# EAGLE design Qwiic_MultiStar (EAGLE 9.5.2)
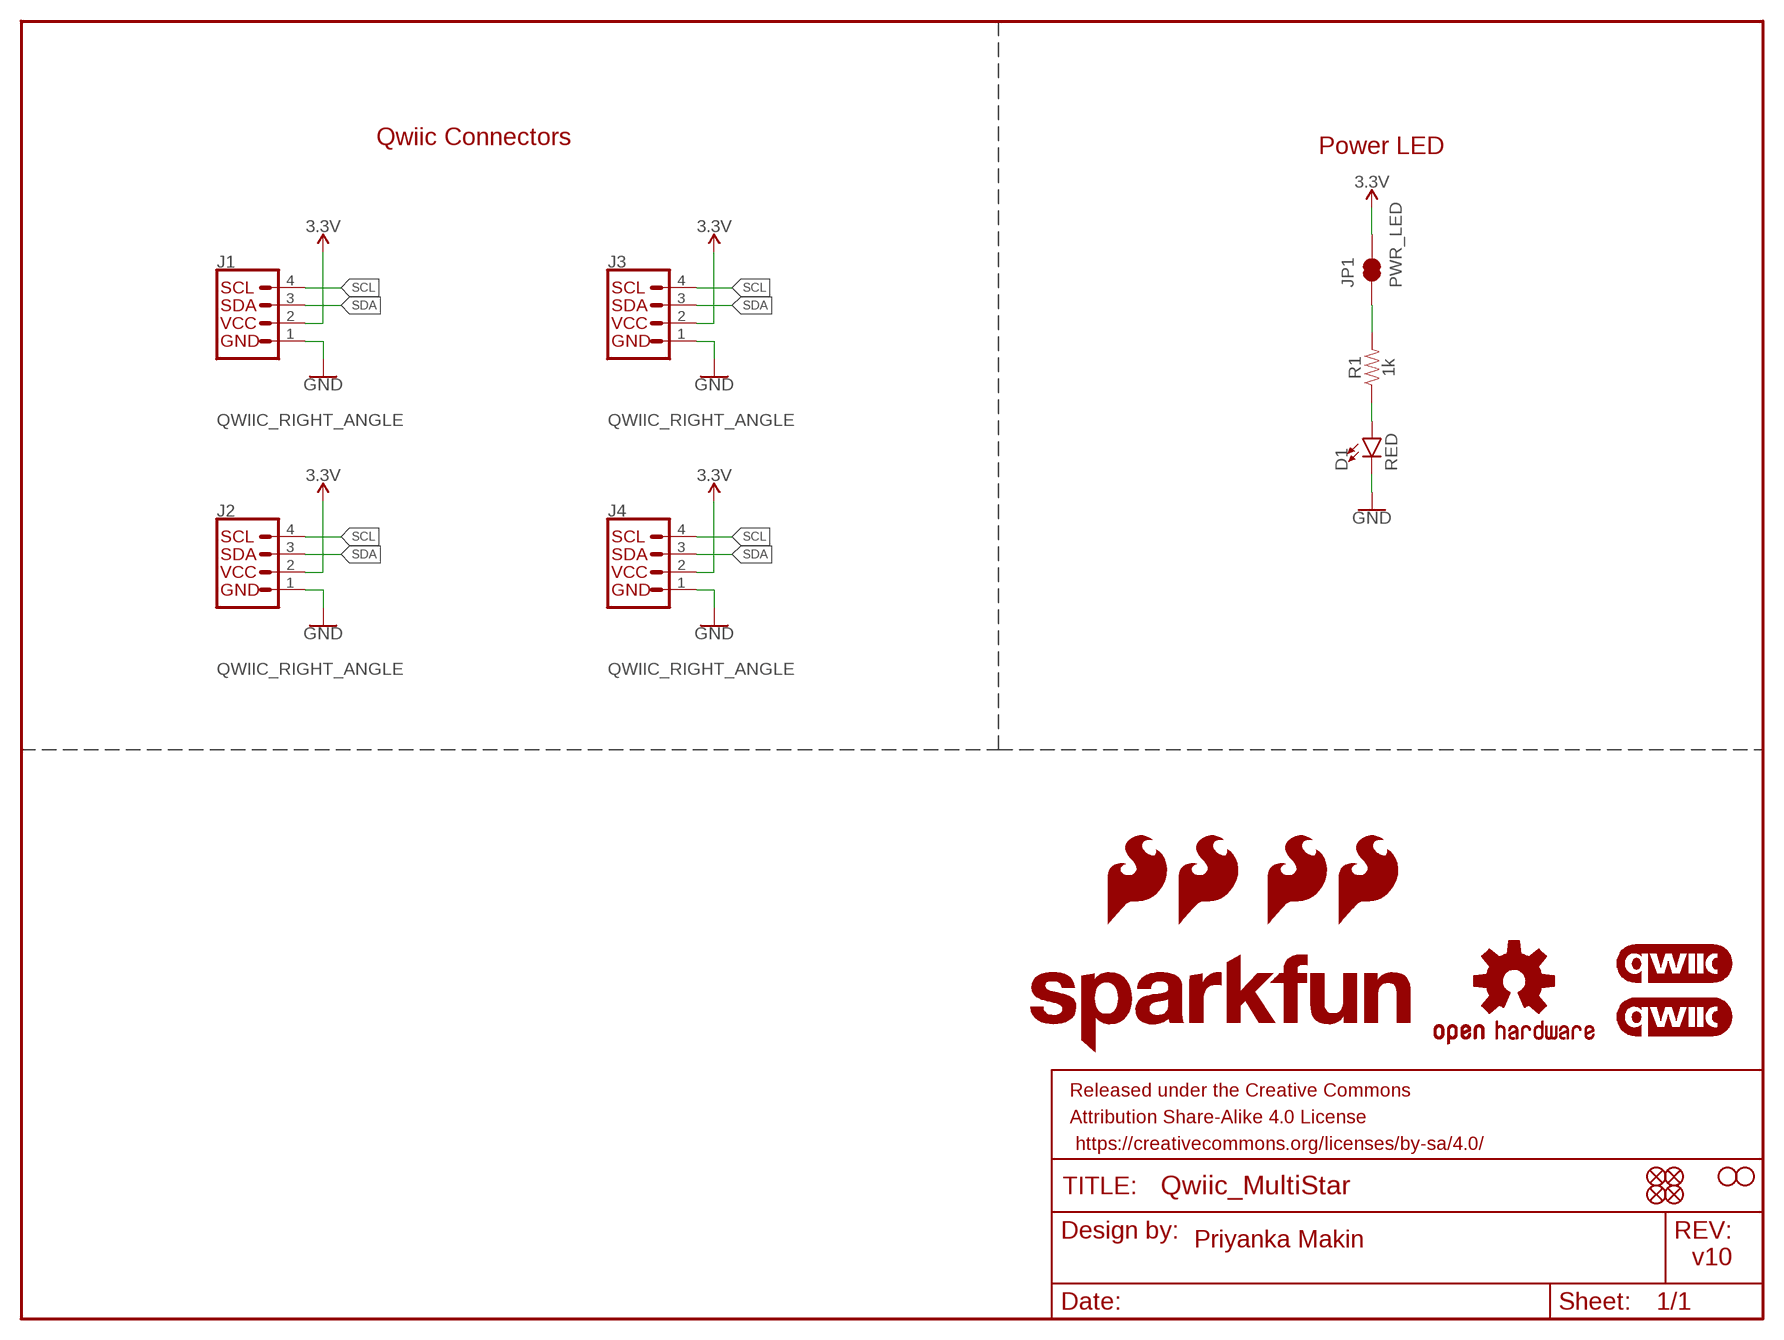
[diagram p0: schematic, sheet 1]

## Parts
D1  RED  LED-RED0603  [LED-0603]
FD1  FIDUCIAL1X2  [FIDUCIAL-1X2]
FD2  FIDUCIAL1X2  [FIDUCIAL-1X2]
FD3  FIDUCIAL1X2  [FIDUCIAL-1X2]
FD4  FIDUCIAL1X2  [FIDUCIAL-1X2]
FRAME1  FRAME-LETTER  [CREATIVE_COMMONS]
H1  STAND-OFFTIGHT  [STAND-OFF-TIGHT]
H2  STAND-OFFTIGHT  [STAND-OFF-TIGHT]
J1  QWIIC_RIGHT_ANGLE  QWIIC_CONNECTORJS-1MM  [JST04_1MM_RA]
J2  QWIIC_RIGHT_ANGLE  QWIIC_CONNECTORJS-1MM  [JST04_1MM_RA]
J3  QWIIC_RIGHT_ANGLE  QWIIC_CONNECTORJS-1MM  [JST04_1MM_RA]
J4  QWIIC_RIGHT_ANGLE  QWIIC_CONNECTORJS-1MM  [JST04_1MM_RA]
JP1  PWR_LED  JUMPER-SMT_2_NC_TRACE_SILK  [SMT-JUMPER_2_NC_TRACE_SILK]
LOGO1  QWIIC_LOGO_5MM  [QWIIC_5MM]
LOGO2  QWIIC_LOGO_5MM  [QWIIC_5MM]
LOGO3  OSHW-LOGOS  [OSHW-LOGO-S]
LOGO4  SFE_LOGO_NAME.2_INCH  [SFE_LOGO_NAME_.2]
LOGO5  SFE_LOGO_FLAME.1_INCH  [SFE_LOGO_FLAME_.1]
LOGO6  SFE_LOGO_FLAME.1_INCH  [SFE_LOGO_FLAME_.1]
LOGO7  SFE_LOGO_FLAME.1_INCH  [SFE_LOGO_FLAME_.1]
LOGO8  SFE_LOGO_FLAME.1_INCH  [SFE_LOGO_FLAME_.1]
R1  1k  1KOHM-0603-1/10W-1%  [0603]

## Nets
3.3V: J1.2 J2.2 J3.2 J4.2 JP1.2
GND: D1.C J1.1 J2.1 J3.1 J4.1
N$1: D1.A R1.1
N$2: JP1.1 R1.2
SCL: J1.4 J2.4 J3.4 J4.4
SDA: J1.3 J2.3 J3.3 J4.3

## Notes on the sheet
- Qwiic Connectors
- Power LED
- Priyanka Makin
- v10

## Library data of the parts
D1 = SparkFun-LED:LED-RED: Red SMD LED Used in manufacturing of most products at SparkFun Packages: 0603 - SMD 0603 package [Product Link] <http://docs.avagotech.com/docs/AV02-0551EN> 0603 SMART - SMD 0603 SMART package ( more efficient and expensive)[Product Link] <http://www.osram-os.com/Graphics/XPic2/00077099_0.pdf> 1206 - SMD1206 package [Product Link] <https://www.sparkfun.com/datasheets/DevTools/LilyPad/Q150OVS4.pdff> SparkFun Products: Pro Mini 328 -5V <https://www.sparkfun.com/products/821> RedBoard <https://www.sparkfun.com/products/12757> IOIO-OTG <https://www.sparkfun.com/products/13613>; PROD_ID: DIO-00819
FD1-FD4 = SparkFun-Aesthetics:FIDUCIAL: Fiducial Alignment Points Point-of-reference for pick-and-place machines and other optical instruments.
FRAME1 = SparkFun-Aesthetics:FRAME-LETTER: Schematic Frame - Letter Standard 8.5x11 US Letter frame
H1 H2 = SparkFun-Hardware:STAND-OFF: Stand Off Drill holes for mechanically mounting via screws, standoffs, etc. Note: Use the keepout ring to avoid running the screw head into surrounding components. Variant Overviews STAND-OFF - Mechanical footprint for a #4 phillips button head screw. STAND-OFF-TIGHT - Mechanical footprint for a #4 phillips button head screw, Example SparkFun Products Screw - Phillips Head (1/4", 4-40, 10 pack) <https://www.sparkfun.com/products/10453> (PRT-10453) Screw - Phillips Head (1/2", 4-40, 10 pack) <https://www.sparkfun.com/products/10452> (PRT-10452) Screw - Phillips Head (3/4", 4-40, 10 pack) <https://www.sparkfun.com/products/10451> (PRT-10451) Screw - Phillips Head (1", 4-40, 10 pack) <https://www.sparkfun.com/products/10450> (PRT-10450)
J1-J4 = SparkFun-Connectors:QWIIC_CONNECTOR: SparkFun I2C Standard Qwiic Connector An SMD 1mm pitch JST connector makes it easy and quick (get it? Qwiic?) to connect I2C devices to each other. The Qwiic system <http://www.sparkfun.com/qwiic> enables fast and solderless connection between popular platforms and various sensors and actuators. We carry 200mm <https://www.sparkfun.com/products/14204>, 100mm <https://www.sparkfun.com/products/14205>, 50mm <https://www.sparkfun.com/products/14206>, and breadboard friendly <https://www.sparkfun.com/products/14207> Qwiic cables. We also offer 10 pcs strips <https://www.sparkfun.com/products/14323> the SMD connectors.; PROD_ID: CONN-13694
JP1 = SparkFun-Jumpers:JUMPER-SMT_2_NC_TRACE: Normally closed trace jumper This jumper has a trace between two pads so it's normally closed (NC). Use a razor knife to open the connection. For best results follow the IPC guidelines for cutting traces: Cutout at least 0.063 mm (0.005 in). Remove all loose material to clean up the cut area. Seal the cut with an approved epoxy. Reapply solder to reclose the connection.
LOGO1 LOGO2 = SparkFun-Aesthetics:QWIIC_LOGO: Qwiic Logos for placement on schematic and PCB. The 5.5mm silk logo is best for placing next to Qwiic connector.
LOGO3 = SparkFun-Aesthetics:OSHW-LOGO: Open-Source Hardware (OSHW) Logo This logo indicates the piece of hardware it is found on incorporates a OSHW license and/or adheres to the definition of open source hardware found here: http://freedomdefined.org/OSHW
LOGO4 = SparkFun-Aesthetics:SFE_LOGO_NAME: SparkFun Font Logo This is the SparkFun name logo. The logo on the schematic will always be the same size; the package variant is the height of the flame part of the logo (or the height the flame would be, if it were drawn). Default layer for the logo on the board is tSilk.
LOGO5-LOGO8 = SparkFun-Aesthetics:SFE_LOGO_FLAME: SparkFun Flame Logo This is the SparkFun flame logo. The logo on the schematic will always be the same size; the package variant is the height of the flame. Default layer for the logo on the board is tSilk.
R1 = SparkFun-Resistors:1KOHM: 1kΩ resistor A resistor is a passive two-terminal electrical component that implements electrical resistance as a circuit element. Resistors act to reduce current flow, and, at the same time, act to lower voltage levels within circuits. - Wikipedia; PROD_ID: RES-07856

## Board
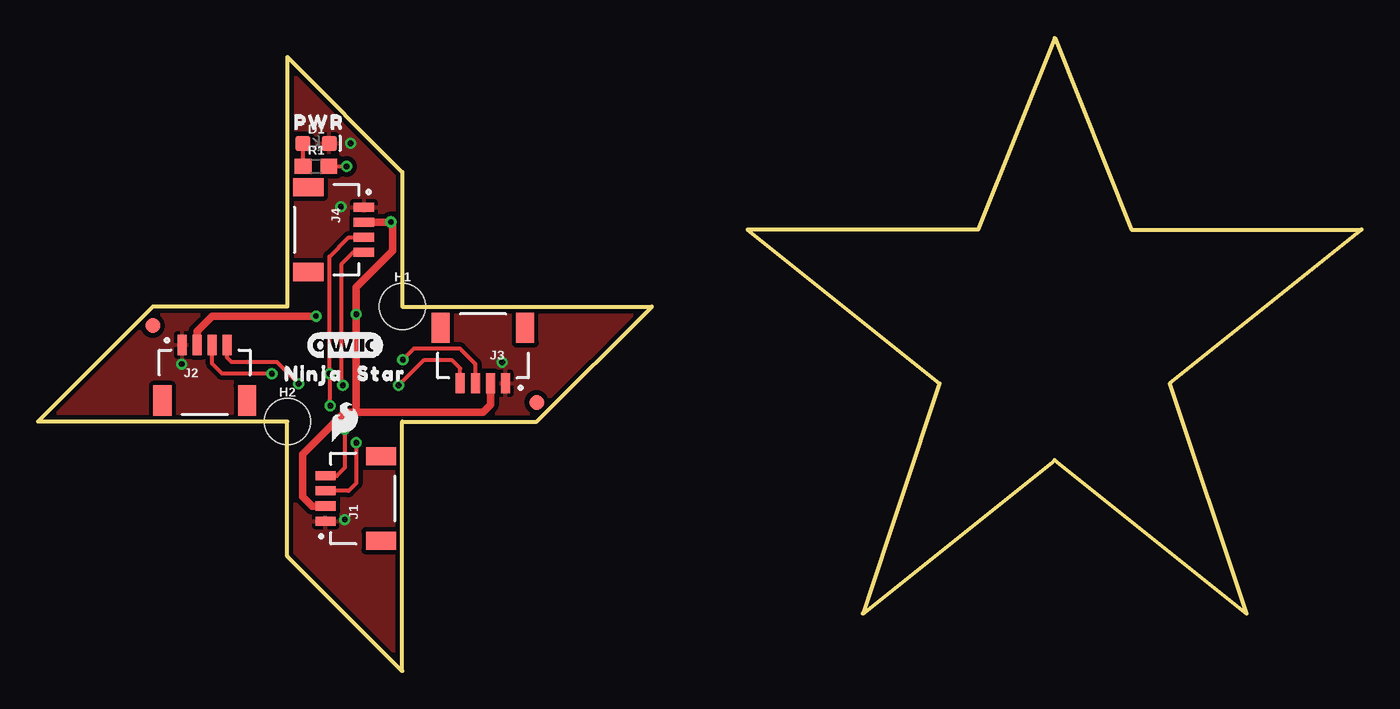
[diagram p1: board, top side]
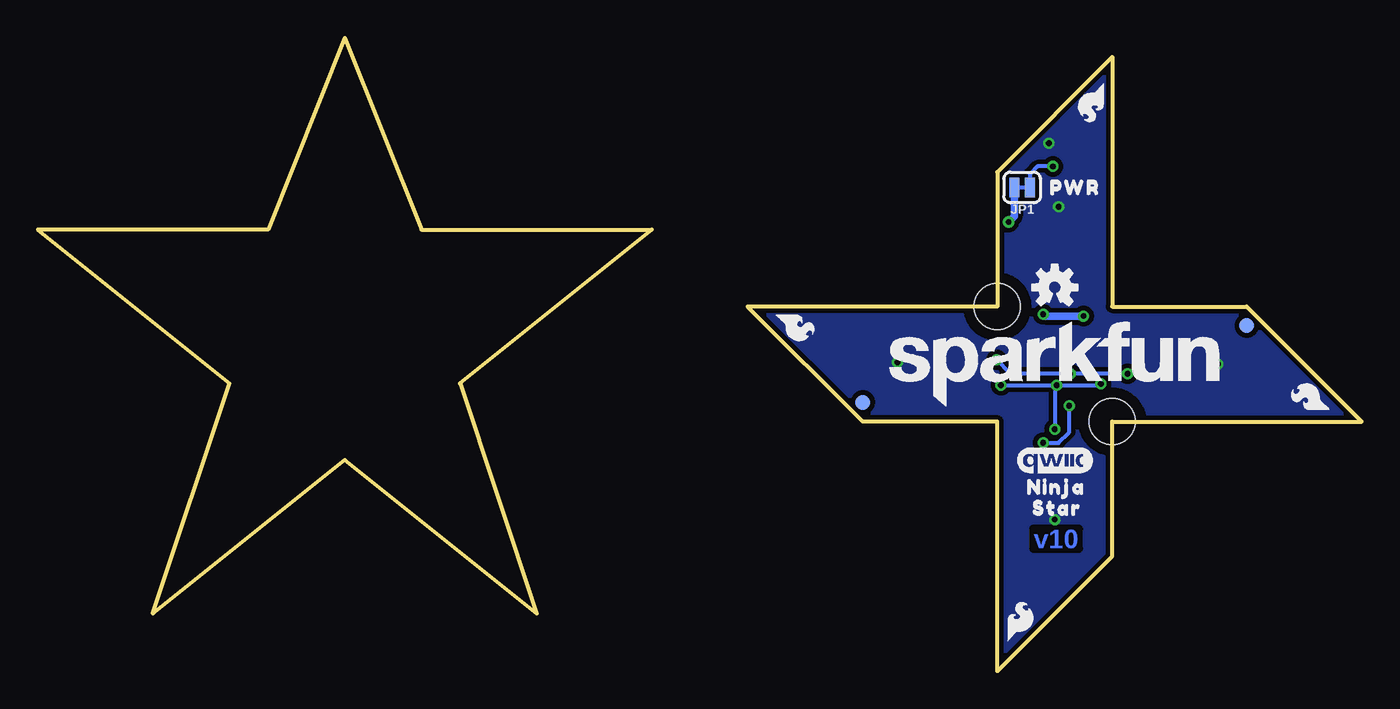
[diagram p2: board, bottom side, seen from below]

Size 87.63 x 41.91 mm. Coordinates in mm from the lower left corner, seen from the top.
Outline: 16.51,7.62 16.51,16.51 0,16.51 7.62,24.13 16.51,24.13 16.51,40.64 24.13,33.02 24.13,24.13 40.64,24.13 33.02,16.51 24.13,16.51 24.13,0 16.51,7.62
Outline: 67.31,41.91 62.23,29.21 46.99,29.21 59.69,19.05 54.61,3.81 67.31,13.97 80.01,3.81 74.93,19.05 87.63,29.21 72.39,29.21 67.31,41.91
Copper layers (1*16): Top 0.035mm / dielectric 1.5mm / Bottom 0.035mm
Design rules "SparkFun-2-Layer-General-JLCPCB": minimum track width 7mil, minimum drill 0.3mm, track to track 7mil, track to pad 7mil, pad to pad 7mil, via to via 7mil, smd to smd 7mil, copper to edge 7mil, drill to drill 7mil, minimum pad ring 7mil, minimum via ring 7mil, stop-mask expansion 3mil, vias tented up to drill 25mil, thermal gap 10mil

### Footprints (pad centres in the part's own frame; a part is rotated, then mirrored left to right if it is on the bottom)
LED-0603 = smd 1 x 1: A -0.877,0; C 0.877,0
FIDUCIAL-1X2 = smd 1 x 1: 1 0,0
STAND-OFF-TIGHT = hole 3.048: 0,0
JST04_1MM_RA = smd 0.6 x 1.35: 1 -1.5,0; 2 -0.5,0; 3 0.5,0; 4 1.5,0 | smd 1.2 x 2: NC1 2.8,-3.675; NC2 -2.8,-3.675
SMT-JUMPER_2_NC_TRACE_SILK = smd 0.66 x 1.27: 1 -0.521,0; 2 0.521,0
0603 = smd 1.1 x 1: 1 -0.85,0; 2 0.85,0

### Placement (x,y rotation side)
D1  18.41,34.92 0 top
FD1  7.62,22.86 0 top
FD2  7.62,22.86 0 bottom
FD3  33.02,17.78 0 top
FD4  33.02,17.78 0 bottom
FRAME1  21.59,-8.89 0 top  (outside the outline)
H1  24.13,24.13 0 top
H2  16.51,16.51 0 top
J1  19.05,11.43 90 top
J2  11.05,21.59 0 top
J3  29.46,19.05 180 top
J4  21.59,29.21 270 top
JP1  22.48,32 180 bottom
LOGO1  20.32,13.97 0 bottom
LOGO2  20.32,21.59 0 top
LOGO3  20.32,25.4 0 bottom
LOGO4  20.32,20.32 0 bottom
LOGO5  37.47,22.73 270 bottom
LOGO6  17.91,37.59 180 bottom
LOGO7  22.61,3.3 0 bottom
LOGO8  3.43,18.16 90 bottom
R1  18.41,33.4 0 top
U$2  [SFE_LOGO_FLAME_.1]  20.32,16.51 0 top
U$3  [NINJA0]  15.62,19.68 0 top
U$4  [PWR0]  21.34,32 0 bottom
U$5  [NINJA0]  22.86,12.19 0 bottom
U$6  [STAR0]  20.45,19.68 0 top
U$7  [STAR0]  22.48,10.79 0 bottom
U$9  [PWR0]  16.26,36.32 0 top

### Tracks (layer width: path | path; a pad name or v marks a point on that pad's centre or on a via)
3.3V  (via drill 0.38)
  Top 0.508: J4.2 v23.37,29.72 23.5,29.72 23.5,27.81 21.08,25.4 v21.08,23.62 21.08,17.14 | J3.2 29.96,17.64 29.46,17.14 21.08,17.14 | J1.2 18.15,10.93 17.53,11.56 17.53,14.35 20.32,17.14 21.08,17.14 | J2.2 10.55,22.49 11.56,23.5 v18.41,23.5
  Bottom 0.508: v21.08,23.62 20.95,23.5 v18.41,23.5 | JP1.2 23,30.09 v23.37,29.72
GND  (via drill 0.38)
  other vias: 20.32,10.03 9.53,20.32 20.07,30.73 30.73,20.45 20.7,34.92
  pour Top (isolate 0.305): 16.51,16.51 0,16.51 7.62,24.13 16.51,24.13 16.51,40.64 24.13,33.02 24.13,24.13 40.64,24.13 33.02,16.51 24.13,16.51 24.13,0 16.51,7.62
  pour Bottom (isolate 0.305): 16.51,16.51 0,16.51 7.62,24.13 16.51,24.13 16.51,40.64 24.13,33.02 24.13,24.13 40.64,24.13 33.02,16.51 24.13,16.51 24.13,0 16.51,7.62
N$1
  Top 0.254: R1.1 17.57,34.9 D1.A
N$2  (via drill 0.38)
  Top 0.254: R1.2 v20.45,33.4
  Bottom 0.254: v20.45,33.4 21.46,33.4 21.97,32.89 21.97,32.02 JP1.1
SCL  (via drill 0.38)
  Top 0.254: v20.19,18.92 20.09,19.03 20.09,26.92 20.88,27.71 J4.4 | v23.88,18.92 25.53,20.57 27.43,20.57 27.96,20.04 J3.4 | v20.32,16 20.32,13.46 19.79,12.93 J1.4 | v17.27,19.01 15.84,20.45 12.83,20.45 12.55,20.73 J2.4
  Bottom 0.254: v20.19,18.92 20.32,18.8 v20.32,16 | v23.88,18.92 v20.19,18.92 | v20.19,18.92 17.36,18.92 v17.27,19.01
SDA  (via drill 0.38)
  Top 0.254: v24.16,20.61 24.89,21.34 27.94,21.34 28.96,20.31 J3.3 | J4.3 20.59,28.71 19.3,27.42 v19.3,19.68 19.36,19.63 v19.36,17.57 | v21.08,15.11 21.08,12.45 20.57,11.93 J1.3 | v15.49,19.68 12.19,19.68 11.55,20.33 J2.3
  Bottom 0.254: v24.16,20.61 23.24,19.68 v19.3,19.68 v15.49,19.68 | v21.08,15.11 20.07,15.11 19.36,15.82 v19.36,17.57

### Text on the board
Bottom: v10
tDocu: Priyanka Makin